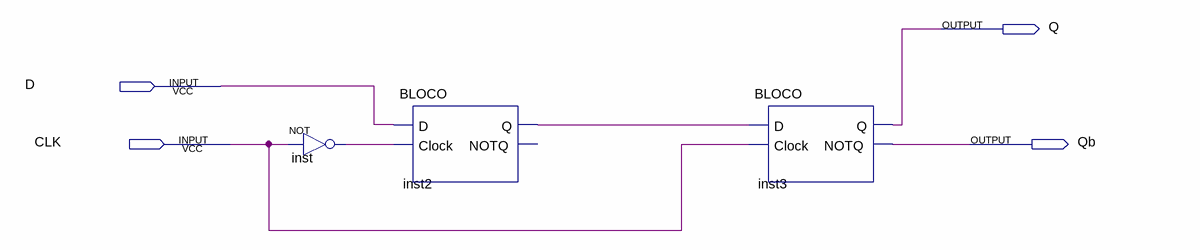
[diagram p0: schematic sheet]
// Quartus schematic PARTE3TESTE.bdf as structural Verilog: 3 symbols, 4 pins
module PARTE3TESTE (
  input  D,
  input  CLK,
  output Q,
  output Qb
);

  wire inst2_q, inst_out;

  not inst (inst_out, CLK);
  BLOCO inst2 (.D(D), .Clock(inst_out), .Q(inst2_q));  // open: NOTQ
  BLOCO inst3 (.D(inst2_q), .Clock(CLK), .Q(Q), .NOTQ(Qb));
endmodule
